# EAGLE design TestAdapter (EAGLE 9.4.2)

## Sheet 1 of 2
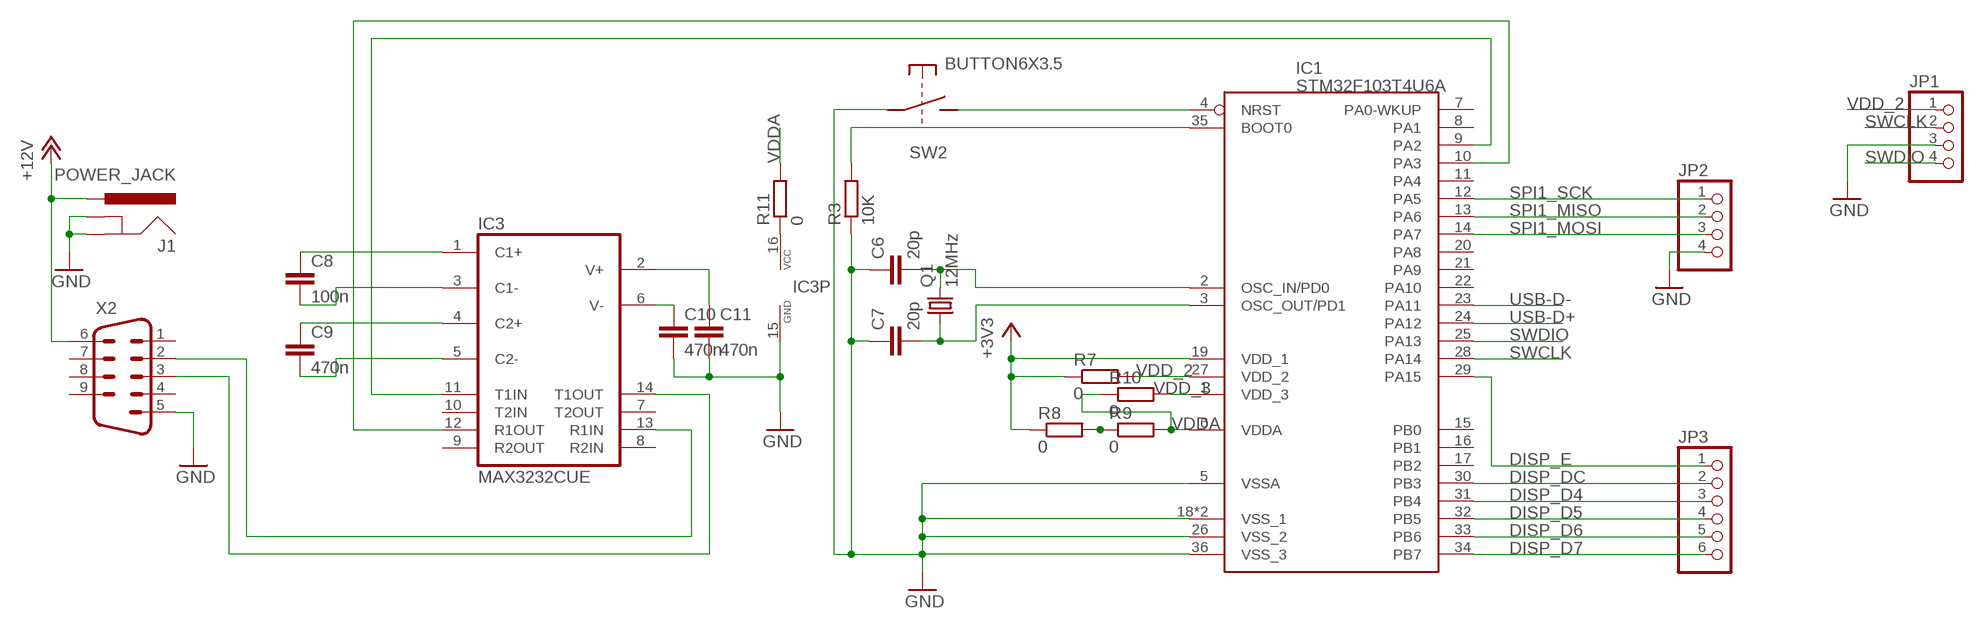
[diagram p0: schematic, sheet 1]

### Parts
C6  20p  CAP_0805  [CAP0805]
C7  20p  CAP_0805  [CAP0805]
C8  100n  CAP_0805  [CAP0805]
C9  470n  CAP_0805  [CAP0805]
C10  470n  CAP_0805  [CAP0805]
C11  470n  CAP_0805  [CAP0805]
IC1  STM32F103T4U6A  [QFN50P606X606X100-36]
IC3  MAX3232CUE  [TSSOP16]
J1  POWER_JACK  [POWER_JACK_PTH]
JP1  PINHD-1X4  [1X04]
JP2  PINHD-1X4  [1X04]
JP3  PINHD-1X6  [1X06]
Q1  12MHz  CRYSTAL5032  [CRYSTAL-5025]
R3  10K  R_R0805  [RESC2012X50]
R7  0  R_R0805  [RESC2012X50]
R8  0  R_R0805  [RESC2012X50]
R9  0  R_R0805  [RESC2012X50]
R10  0  R_R0805  [RESC2012X50]
R11  0  R_R0805  [RESC2012X50]
SW2  BUTTON6X3.5  [SW-6X3.5]
X2  M09-182  [182-009-MALE]

### Nets
+3V3: IC1.19(VDD_1) R7.1 R8.1 ; also sheet 2
+12V: J1.PWR X2.6
DISP_D4: IC1.31(PB4) JP3.3
DISP_D5: IC1.32(PB5) JP3.4
DISP_D6: IC1.33(PB6) JP3.5
DISP_D7: IC1.34(PB7) JP3.6
DISP_DC: IC1.30(PB3) JP3.2
DISP_E: IC1.29(PA15) JP3.1
GND: C6.1 C7.1 C10.2 C11.2 IC1.5(VSSA) IC1.18(VSS_1) IC1.26(VSS_2) IC1.36(VSS_3) IC1.P$1(VSS_1) IC3.15(GND) J1.GND J1.GNDBREAK JP1.3 JP2.4 R3.1 SW2.1 X2.5 ; also sheet 2
N$2: C7.2 IC1.3(OSC_OUT/PD1) Q1.P$1
N$3: C6.2 IC1.2(OSC_IN/PD0) Q1.P$2
N$4: IC1.35(BOOT0) R3.2
N$5: IC1.4(NRST) SW2.2
N$6: IC3.16(VCC) R11.1
N$7: R8.2 R9.1
N$16: IC1.9(PA2) IC3.11(T1IN)
N$17: IC1.10(PA3) IC3.12(R1OUT)
N$27: IC3.14(T1OUT) X2.3
N$28: IC3.13(R1IN) X2.2
N$29: C8.1 IC3.1(C1+)
N$30: C8.2 IC3.3(C1-)
N$31: C9.1 IC3.4(C2+)
N$32: C9.2 IC3.5(C2-)
N$33: C11.1 IC3.2(V+)
N$34: C10.1 IC3.6(V-)
SPI1_MISO: IC1.13(PA6) JP2.2
SPI1_MOSI: IC1.14(PA7) JP2.3
SPI1_SCK: IC1.12(PA5) JP2.1
SWCLK: IC1.28(PA14) JP1.2
SWDIO: IC1.25(PA13) JP1.4
USB-D+: IC1.24(PA12) ; also sheet 2
USB-D-: IC1.23(PA11) ; also sheet 2
VDD_2: IC1.27(VDD_2) JP1.1 R7.2 ; also sheet 2
VDD_3: IC1.1(VDD_3) R10.2 ; also sheet 2
VDDA: IC1.6(VDDA) R9.2 R10.1 R11.2
Unconnected: IC1.7(PA0-WKUP) IC1.8(PA1) IC1.11(PA4) IC1.15(PB0) IC1.16(PB1) IC1.17(PB2) IC1.20(PA8) IC1.21(PA9) IC1.22(PA10) IC3.7(T2OUT) IC3.8(R2IN) IC3.9(R2OUT) IC3.10(T2IN) X2.1 X2.4 X2.7 X2.8 X2.9

## Sheet 2 of 2
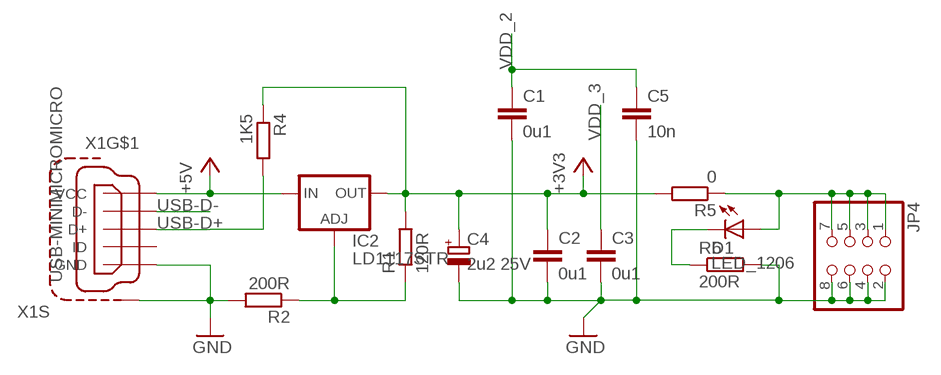
[diagram p1: schematic, sheet 2]

### Parts
C1  0u1  CAP_0805  [CAP0805]
C2  0u1  CAP_0805  [CAP0805]
C3  0u1  CAP_0805  [CAP0805]
C4  2u2 25V  CAP-POL_CAPE3216-A  [CAPMP3317X180]
C5  10n  CAP_0805  [CAP0805]
D1  LED_1206  [LED1206]
IC2  LD1117STR  VREG-ADJLD1117S  [SOT230P700X180-4]
JP4  PINHD-2X4  [2X04]
R1  120R  R_R0805  [RESC2012X50]
R2  200R  R_R0805  [RESC2012X50]
R4  1K5  R_R0805  [RESC2012X50]
R5  0  R_R0805  [RESC2012X50]
R6  200R  R_R0805  [RESC2012X50]
X1  USB-MINIMICROMICRO  [USB-B-MICRO-SMD]

### Nets
+3V3: C2.1 C4.1(+) IC2.2(OUT) IC2.4(OUT) R1.2 R4.1 R5.2 ; also sheet 1
+5V: IC2.3(IN) X1.VBUS(VCC)
GND: C1.2 C2.2 C3.2 C4.2(-) C5.2 JP4.2 JP4.4 JP4.6 JP4.8 R2.2 R6.2 X1.GND X1.SHIELD1(S:S1) X1.SHIELD2(S:S1) X1.SHIELD3(S:S1) ; also sheet 1
N$1: IC2.1(ADJ) R1.1 R2.1
N$25: D1.A JP4.1 JP4.3 JP4.5 JP4.7 R5.1
N$26: D1.C R6.1
USB-D+: R4.2 X1.D+ ; also sheet 1
USB-D-: X1.D- ; also sheet 1
VDD_2: C1.1 C5.1 ; also sheet 1
VDD_3: C3.1 ; also sheet 1
Unconnected: X1.ID

## Library data of the parts
C1-C3 C5-C11 = Flamberm:CAP_
C4 = Flamberm:CAP-POL_
D1 = Flamberm:LED_
IC1 = Flamberm:STM32F103T4U6A
IC2 = Flamberm:VREG-ADJ: VOLTAGE REGULATOR
IC3 = maxim:MAX3232*: True RS-232 Transceivers 3.0V to 5.5V, Low-Power up to 1Mbps, Using Four 0.1µF External Capacitors Source: http://pdfserv.maxim-ic.com/en/ds/MAX3222-MAX3241.pdf; MF: MAXIM; MPN: MAX3232CUE+; OC_FARNELL: 1593350; OC_NEWARK: 68K4629
J1 = SparkFun-Connectors:POWER_JACK: Power Jack Connector This is the standard 5.5mm barrel jack for power. The PTH is the most common, proven, reliable, footprint. The Slot footprint only works if the mill layer is transmitted to the PCB fab house so be warned. Here are the connectors we sell at SparkFun: DC Barrel Power Jack/Connector <https://www.sparkfun.com/products/119> (PRT-00119) DC Barrel Power Jack/Connector (SMD) <https://www.sparkfun.com/products/12748> (PRT-12748) DC Barrel Jack Adapter - Breadboard Compatible <https://www.sparkfun.com/products/10811> (PRT-10811) It is used on this SparkFun product (and many, many others): SparkFun RedBoard - Programmed with Arduino <https://www.sparkfun.com/products/12757> (DEV-12757) Also, if you need a mating power supply or connector, please check these out: Wall Adapter Power Supply - 9VDC 650mA <https://www.sparkfun.com/products/298> (TOL-00298) DC Barrel Jack Adapter - Male <https://www.sparkfun.com/products/10287> (PRT-10287); PROD_ID: CONN-08197
JP1 JP2 = pinhead:PINHD-1X4: PIN HEADER
JP3 = pinhead:PINHD-1X6: PIN HEADER
JP4 = pinhead:PINHD-2X4: PIN HEADER
Q1 = Flamberm:CRYSTAL
R1-R11 = Flamberm:R_
SW2 = Flamberm:BUTTON
X1 = Flamberm:USB-MINIMICRO: MINI USB-B Conector Source: www.cypressindustries.com
X2 = con-subd:M09: SUB-D; OC_FARNELL: unknown; OC_NEWARK: unknown

## Board
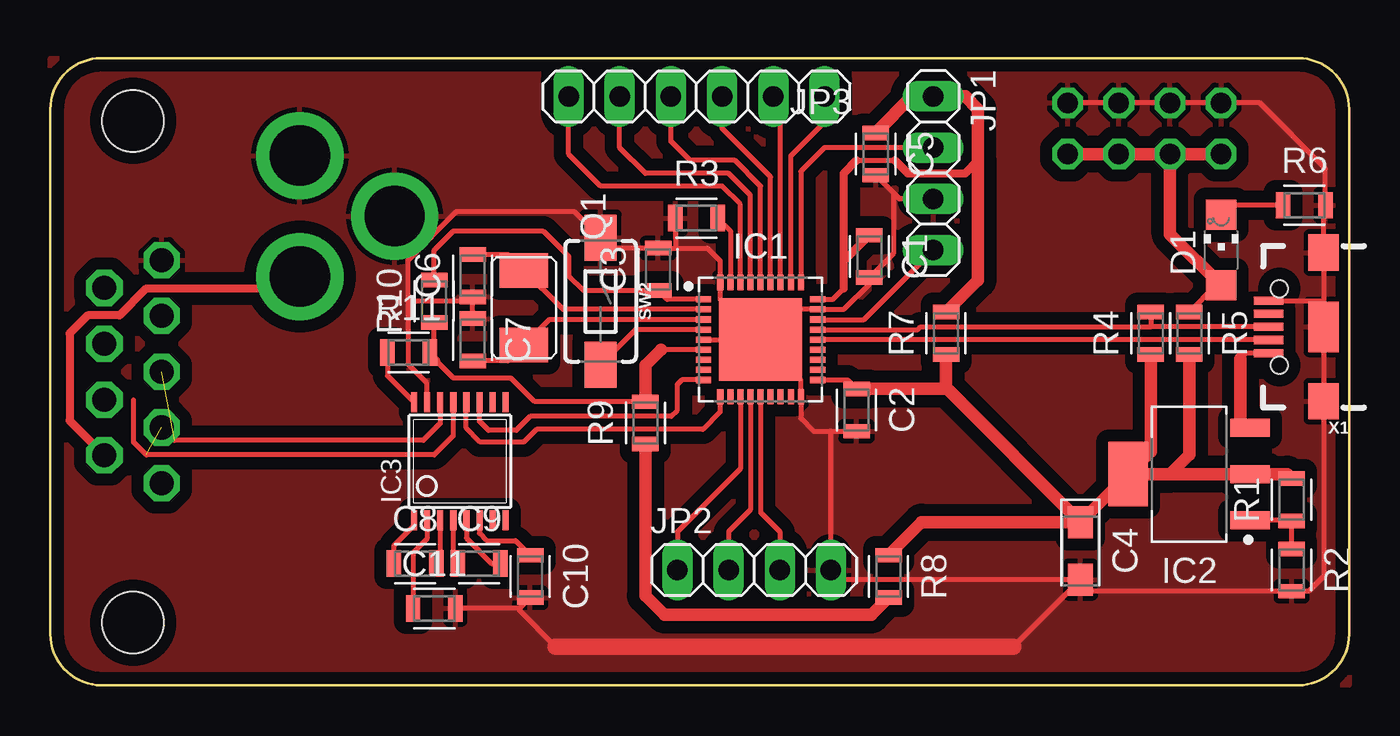
[diagram p2: board, top side]
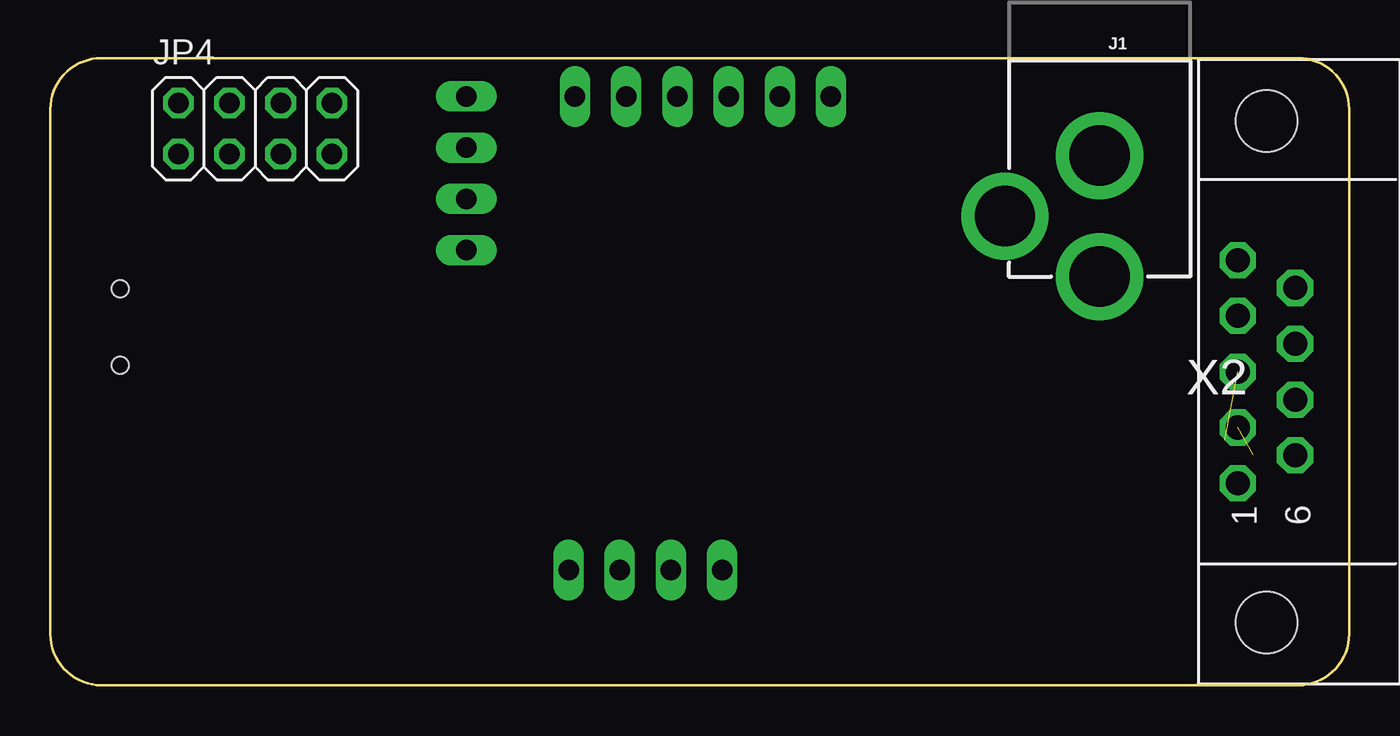
[diagram p3: board, bottom side, seen from below]

Size 64.45 x 31.11 mm. Coordinates in mm from the lower left corner, seen from the top.
Outline: 64.45,2.54 64.45,28.57 arc90 61.91,31.11 2.54,31.11 arc90 0,28.57 0,2.54 arc90 2.54,0 61.91,0 arc90 64.45,2.54
Copper layers (1*16): Top 0.035mm / dielectric 1.5mm / Bottom 0.035mm
Design rules "EagleDesignRules *": minimum track width 0.25mm, minimum drill 0.3mm, track to track 0.2mm, track to pad 0.2mm, pad to pad 0.2mm, via to via 0.2mm, smd to smd 0.2mm, copper to edge 0.5mm, drill to drill 0.5mm, minimum pad ring 10mil, minimum via ring 8mil, stop-mask expansion 4mil, vias tented up to drill 0mil, thermal gap 0.25mm

### Footprints (pad centres in the part's own frame; a part is rotated, then mirrored left to right if it is on the bottom)
CAP0805 = smd 0.712 x 1.312: 1 -1.05,0; 2 1.05,0
CAPMP3317X180 = smd 1.579 x 1.25: 1 -1.425,0; 2 1.425,0
LED1206 = smd 1.5 x 1.5: A 0,-1.75; C 0,1.75
QFN50P606X606X100-36 = smd 0.75 x 0.3: 1 -2.838,2; 2 -2.838,1.5; 3 -2.838,1; 4 -2.838,0.5; 5 -2.838,0; 6 -2.838,-0.5; 7 -2.838,-1; 8 -2.838,-1.5; 9 -2.838,-2; 19 2.838,-2; 20 2.838,-1.5; 21 2.838,-1; 22 2.838,-0.5; 23 2.838,0; 24 2.838,0.5; 25 2.838,1; 26 2.838,1.5; 27 2.838,2 | smd 0.3 x 0.75: 10 -2,-2.838; 11 -1.5,-2.838; 12 -1,-2.838; 13 -0.5,-2.838; 14 0,-2.838; 15 0.5,-2.838; 16 1,-2.838; 17 1.5,-2.838; 18 2,-2.838; 28 2,2.838; 29 1.5,2.838; 30 1,2.838; 31 0.5,2.838; 32 0,2.838; 33 -0.5,2.838; 34 -1,2.838; 35 -1.5,2.838; 36 -2,2.838 | smd 4.1 x 4.1: P$1 0,0
SOT230P700X180-4 = smd 1.965 x 0.889: 1 -3.023,2.3; 2 -3.023,0; 3 -3.023,-2.3 | smd 1.965 x 3.189: 4 3.023,0
TSSOP16 = smd 0.305 x 0.991: 1 -2.275,-2.918; 2 -1.625,-2.918; 3 -0.975,-2.918; 4 -0.325,-2.918; 5 0.325,-2.918; 6 0.975,-2.918; 7 1.625,-2.918; 8 2.275,-2.918; 9 2.275,2.918; 10 1.625,2.918; 11 0.975,2.918; 12 0.325,2.918; 13 -0.325,2.918; 14 -0.975,2.918; 15 -1.625,2.918; 16 -2.275,2.918
POWER_JACK_PTH = drill 2.997 pad 4.318: GND 0,7.7; GNDBREAK 4.7,10.7; PWR 0,13.7
1X04 = drill 1.016 long: 1 -3.81,0; 2 -1.27,0; 3 1.27,0; 4 3.81,0
1X06 = drill 1.016 long: 1 -6.35,0; 2 -3.81,0; 3 -1.27,0; 4 1.27,0; 5 3.81,0; 6 6.35,0
2X04 = drill 1.016 octagon: 1 -3.81,-1.27; 2 -3.81,1.27; 3 -1.27,-1.27; 4 -1.27,1.27; 5 1.27,-1.27; 6 1.27,1.27; 7 3.81,-1.27; 8 3.81,1.27
CRYSTAL-5025 = smd 1.7 x 2.4: P$1 1.85,0; P$2 -1.85,0
RESC2012X50 = smd 0.712 x 1.312: 1 -1.05,0; 2 1.05,0
SW-6X3.5 = smd 2.3 x 1.6: 1 -3.15,0; 2 3.15,0
USB-B-MICRO-SMD = smd 1.45 x 0.4: D+ 2.725,0; D- 2.725,0.65; GND 2.725,-1.3; ID 2.725,-0.65; VBUS 2.725,1.3 | smd 1.5 x 1.8: SHIELD1 0,3.685; SHIELD2 0,-3.685 | smd 1.5 x 2.5: SHIELD3 0,0 | hole 0.85: 2.2,1.9; 2.2,-1.9
182-009-MALE = drill 1.194 pad 1.524 octagon: 1 -5.537,10.923; 2 -2.769,10.923; 3 0,10.923; 4 2.769,10.923; 5 5.537,10.923; 6 -4.153,8.08; 7 -1.384,8.08; 8 1.384,8.08; 9 4.153,8.08 | hole 3.048: -12.446,9.501; 12.446,9.501

### Placement (x,y rotation side)
C1  40.64,21.27 270 top
C2  40.01,13.65 270 top
C3  30.16,20.64 90 top
C4  51.12,6.67 270 top
C5  40.96,26.35 270 top
C6  20.96,20.32 90 top
C7  20.96,17.14 270 top
C8  18.1,6.03 0 top
C9  21.27,6.03 0 top
C10  23.81,5.4 270 top
C11  19.05,3.81 0 top
D1  58.1,21.59 0 top
IC1  35.24,17.14 0 top
IC2  56.52,10.48 180 top
IC3  20.32,11.11 0 top
J1  12.38,33.97 180 bottom
JP1  43.81,25.4 270 top
JP2  34.93,5.71 0 top
JP3  32.07,29.21 180 top
JP4  54.29,27.62 0 bottom
Q1  23.5,18.73 270 top
R1  61.59,9.21 90 top
R2  61.59,5.71 270 top
R3  32.07,23.18 0 top
R4  54.61,17.46 90 top
R5  56.52,17.46 270 top
R6  62.23,23.81 0 top
R7  44.45,17.46 90 top
R8  41.59,5.4 270 top
R9  29.53,13.02 90 top
R10  19.05,19.05 90 top
R11  17.78,16.51 0 top
SW2  27.3,19.05 270 top
X1  63.18,17.78 180 top
X2  -5.4,15.56 90 bottom

### Tracks (layer width: path | path; a pad name or v marks a point on that pad's centre or on a via)
+3V3
  Top 0.254: 61.37,10.48 R1.2 | IC2.4 | 55.26,10.48 55.24,10.47 | IC1.19 39.56,15.14 C2.1 | 44.45,14.7 44.51,14.7
  Top 0.61: 61.37,10.48 IC2.2 55.26,10.48 | IC2.4 54.61,11.58 R4.1 | IC2.4 C4.1 | R5.2 56.51,11.43 55.55,10.47 55.24,10.47 IC2.4 | C2.1 44.45,14.7 R7.1 | 44.51,14.7 C4.1 | R8.1 43.24,8.09 C4.1
+5V
  Top 0.254: X1.VBUS 59.34,16.48 59.05,16.19 | 59.05,13.26 IC2.3
  Top 0.61: 59.05,16.19 59.05,13.26
+12V
  Top 0.406: X2.6 0.95,13.13 0.95,17.46 1.84,18.35 3.43,18.35 4.76,19.68 11.8,19.68 J1.PWR
DISP_D4
  Top 0.254: IC1.31 35.74,25.22 33.34,27.62 JP3.3
DISP_D5
  Top 0.254: IC1.32 35.24,24.77 33.97,26.04 31.75,26.04 30.8,26.99 JP3.4
DISP_D6
  Top 0.254: IC1.33 34.74,24.31 33.66,25.4 29.53,25.4 28.26,26.67 JP3.5
DISP_D7
  Top 0.254: IC1.34 34.24,23.86 33.34,24.77 27.3,24.77 25.72,26.35 JP3.6
DISP_DC
  Top 0.254: IC1.30 36.24,28.84 JP3.2
DISP_E
  Top 0.254: IC1.29 36.74,26.27 38.42,27.94 JP3.1
GND
  Top 0.254: C10.2 23.27,3.81 | 23.27,3.81 C11.2 | 17.74,19.05 17.74,15.94 18.69,14.98 IC3.15 | 17.74,19.05 17.74,21.09 20.14,23.5 26.01,23.5 SW2.1 27.82,21.69 C3.2 31.02,21.69 | 63.18,19.05 X1.SHIELD2 63.18,23.72 R6.2 63.28,25.62 60.01,28.89 JP4.2 JP4.4 JP4.6 JP4.8 | 63.18,19.05 X1.SHIELD3 X1.SHIELD1 63.18,5.4 62.45,4.67 R2.2 51.69,4.67 C4.2 | X1.GND 63.15,19.08 63.18,19.05 | 31.02,21.69 32.61,21.69 33.24,21.05 IC1.36 33.24,19.14 34.61,17.78 34.61,17.14 | R3.1 31.02,21.69 | 38.74,12.6 37.88,12.6 37.24,13.24 IC1.18 37.24,15.14 IC1.P$1 | 38.74,12.6 C2.2 | C7.1 20.96,19.05 | 20.96,19.05 C6.1 | 20.96,19.05 17.74,19.05 | JP1.3 42.13,24.13 41.86,24.4 | 41.86,24.4 C5.2 | 38.74,12.6 JP2.4 39.21,5.24 C4.2 | IC1.5 34.61,17.14 | 34.61,17.14 IC1.P$1 | IC1.P$1 35.24,17.46 36.42,18.64 IC1.26 39.38,18.64 40.64,19.91 C1.2 41.86,21.44 41.86,24.4 | C4.2 47.78,1.91 | 25.08,1.91 23.27,3.71 23.27,3.81
  Top 0.813: 47.78,1.91 25.08,1.91 | J1.GNDBREAK 17.08,23.42
  pour Top (isolate 0.61): 0,31.11 61.91,31.11 arc-90 64.45,28.57 64.45,0 2.54,0 arc-90 0,2.54
N$1
  Top 0.254: R2.1 R1.1 61.57,8.18 IC2.1
N$2
  Top 0.254: IC1.3 24.76,18.14 Q1.P$1 22.71,16.09 C7.2
N$3
  Top 0.254: IC1.2 25.43,18.64 Q1.P$2 22.71,21.37 C6.2
N$4
  Top 0.254: R3.2 33.74,22.55 IC1.35
N$5
  Top 0.254: IC1.4 29.05,17.64 SW2.2
N$6
  Top 0.254: R11.1 16.73,15.35 IC3.16
N$7
  Top 0.61: R9.1 29.53,4.45 30.48,3.49 40.74,3.49 R8.2
N$16
  Top 0.254: IC3.11 21.3,13.09 21.74,12.65 23.11,12.65 23.81,13.34 30.81,13.34 31.11,13.65 31.11,14.92 31.34,15.14 IC1.9
N$17
  Top 0.254: IC3.12 20.64,12.76 21.34,12.06 23.49,12.06 24.13,12.7 32.39,12.7 33.24,13.56 IC1.10
N$25
  Top 0.254: R5.1 57.84,19.84 D1.A
  Top 0.61: D1.A 55.56,22.38 JP4.3 | JP4.3 JP4.5 JP4.7 | JP4.3 JP4.1
N$26
  Top 0.254: R6.1 58.57,23.81 D1.C
N$27  (1 unrouted)
  Top 0.254: IC3.14 19.34,12.99 18.5,12.15 6.16,12.15
N$28  (1 unrouted)
  Top 0.254: IC3.13 19.99,12.38 19.05,11.43 4.76,11.43 4.13,12.06 4.13,14.16
N$29
  Top 0.254: IC3.1 18.05,7.94 17.05,6.94 C8.1
N$30
  Top 0.254: IC3.3 19.34,6.23 C8.2
N$31
  Top 0.254: IC3.4 19.99,6.26 C9.1
N$32
  Top 0.254: IC3.5 20.65,7.3 21.91,6.03 C9.2
N$33
  Top 0.254: IC3.2 18.69,7.27 18,6.57 C11.1
N$34
  Top 0.254: IC3.6 21.3,7.53 21.65,7.18 23.08,7.18 C10.1
SPI1_MISO
  Top 0.254: IC1.13 34.74,8.71 33.66,7.62 JP2.2
SPI1_MOSI
  Top 0.254: IC1.14 35.24,8.57 36.2,7.62 JP2.3
SPI1_SCK
  Top 0.254: IC1.12 34.24,10.75 31.11,7.62 JP2.1
SWCLK
  Top 0.254: JP1.2 38.42,26.67 37.24,25.5 IC1.28
SWDIO
  Top 0.254: IC1.25 40.37,18.14 JP1.4
USB-D+
  Top 0.254: X1.D+ 54.61,17.78 | R4.2 54.61,17.78 | IC1.24 43.05,17.64 43.18,17.78 54.61,17.78
USB-D-
  Top 0.254: IC1.23 53.64,17.14 53.66,17.13 X1.D-
VDD_2
  Top 0.254: IC1.27 38.83,19.14 39.37,19.68 | 40,26.04 41.91,26.04 | 42.76,29.21 JP1.1
  Top 0.406: 39.37,19.68 39.37,21.05 | 39.37,21.05 C1.1 | 39.37,21.05 39.37,25.4 40,26.04 | 41.91,26.04 42.55,25.4 45.4,25.4 46.04,26.04
  Top 0.61: JP1.1 45.4,29.21 46.04,28.57 46.04,26.04 46.04,20.1 R7.2 | C5.1 42.76,29.21
VDD_3
  Top 0.254: R10.2 19.05,21.59 20,22.54 24.45,22.54 25.72,21.27 25.72,20.32 26.45,19.59 C3.1 30.6,19.14 IC1.1
VDDA
  Top 0.254: IC1.6 30.3,16.64 | R9.2 24.03,14.07 22.86,15.24 20,15.24 19.21,16.03 | 19.21,16.03 19.05,16.19 R10.1 | R11.2 19.21,16.13 19.21,16.03
  Top 0.61: 30.3,16.64 29.53,15.88 R9.2